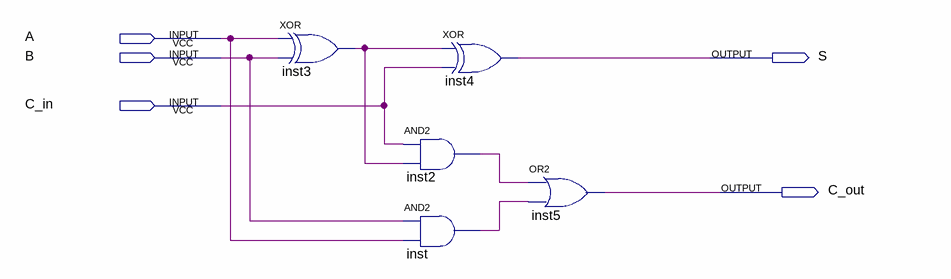
[diagram p0: schematic sheet]
// Quartus schematic FullAdder.bdf as structural Verilog: 5 symbols, 5 pins
module FullAdder (
  input  A,
  input  B,
  input  C_in,
  output S,
  output C_out
);

  wire inst2_out, inst3_out, inst_out;

  xor inst3 (inst3_out, A, B);
  and inst2 (inst2_out, C_in, inst3_out);
  and inst (inst_out, B, A);
  xor inst4 (S, inst3_out, C_in);
  or inst5 (C_out, inst2_out, inst_out);
endmodule
